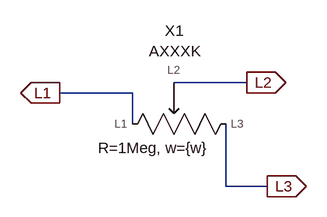
[diagram p0: schematic A1000K.asc]
A1000K.asc, the LTspice schematic file:
Version 4
SHEET 1 880 680
WIRE 112 272 0 272
WIRE -64 288 -176 288
WIRE -64 336 -64 288
WIRE 80 432 80 336
WIRE 144 432 80 432
FLAG 112 272 L2
IOPIN 112 272 Out
FLAG -176 288 L1
IOPIN -176 288 Out
FLAG 144 432 L3
IOPIN 144 432 Out
SYMBOL Base_AxxxK 0 272 R0
WINDOW 39 -31 101 Center 2
SYMATTR SpiceLine R=1Meg, w={w}
SYMATTR InstName X1

The netlist it stands for:
* A1000K.asc
XX1 L1 L2 L3 AXXXK R=1Meg, w={w}  ; pins L1 L2 L3
.backanno
.end